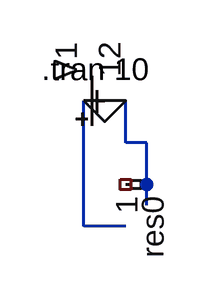
[diagram p0: schematic save2.asc]
save2.asc, the LTspice schematic file:
Version 4
SHEET 1 72 128
WIRE 32 0 16 0
WIRE 32 32 32 0
WIRE 48 32 32 32
WIRE 48 64 48 32
WIRE 48 80 48 64
WIRE 0 96 0 0
WIRE 32 96 0 96
FLAG 16 0 0
SYMBOL _app\\myvoltage 0 0 R270
SYMATTR InstName V1
SYMATTR Value 12
SYMBOL _app\\appres 32 64 R0
SYMATTR InstName res0
SYMATTR Value 1
TEXT -32 -24 Left 2 !.tran 10

The netlist it stands for:
* save2.asc
V1 N001 0 12
res0 0 NC_01 1
.tran 10
.backanno
.end